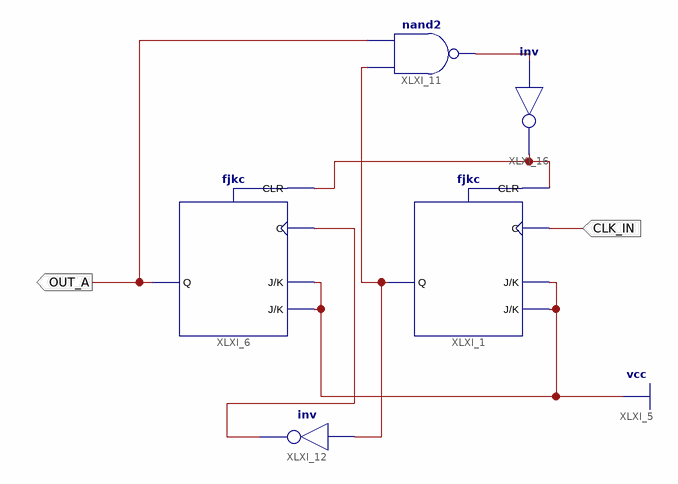
[diagram p0: schematic sheet 1]
// Xilinx ISE schematic mod3.sch (spartan6) as structural Verilog: 5 symbols, 2 ports
module mod3 (
  input  CLK_IN,
  output OUT_A
);

  wire XLXN_43, XLXN_47, XLXN_96, XLXN_113;

  fjkc XLXI_6 (.C(XLXN_113), .CLR(XLXN_96), .J(1'b1), .K(1'b1), .Q(OUT_A));
  nand XLXI_11 (XLXN_43, XLXN_47, OUT_A);
  not XLXI_16 (XLXN_96, XLXN_43);
  not XLXI_12 (XLXN_113, XLXN_47);
  fjkc XLXI_1 (.C(CLK_IN), .CLR(XLXN_96), .J(1'b1), .K(1'b1), .Q(XLXN_47));
endmodule
